# EasyEDA Pro project ProProject_TDeck_18650_Charger_2024-02-10.epro

# Schematic Schematic1
Create Date: 2024-02-10; Page Name: P1; Project Name: TDeck_18650_Charger; Schematic Name: Schematic1; Update Date: 2024-02-10; Company: EasyEDA.com; Drawn: EasyEDA; Page Size: A4; Part Number: JLCPCB-002; Reviewed: EasyEDA; Version: V0.1
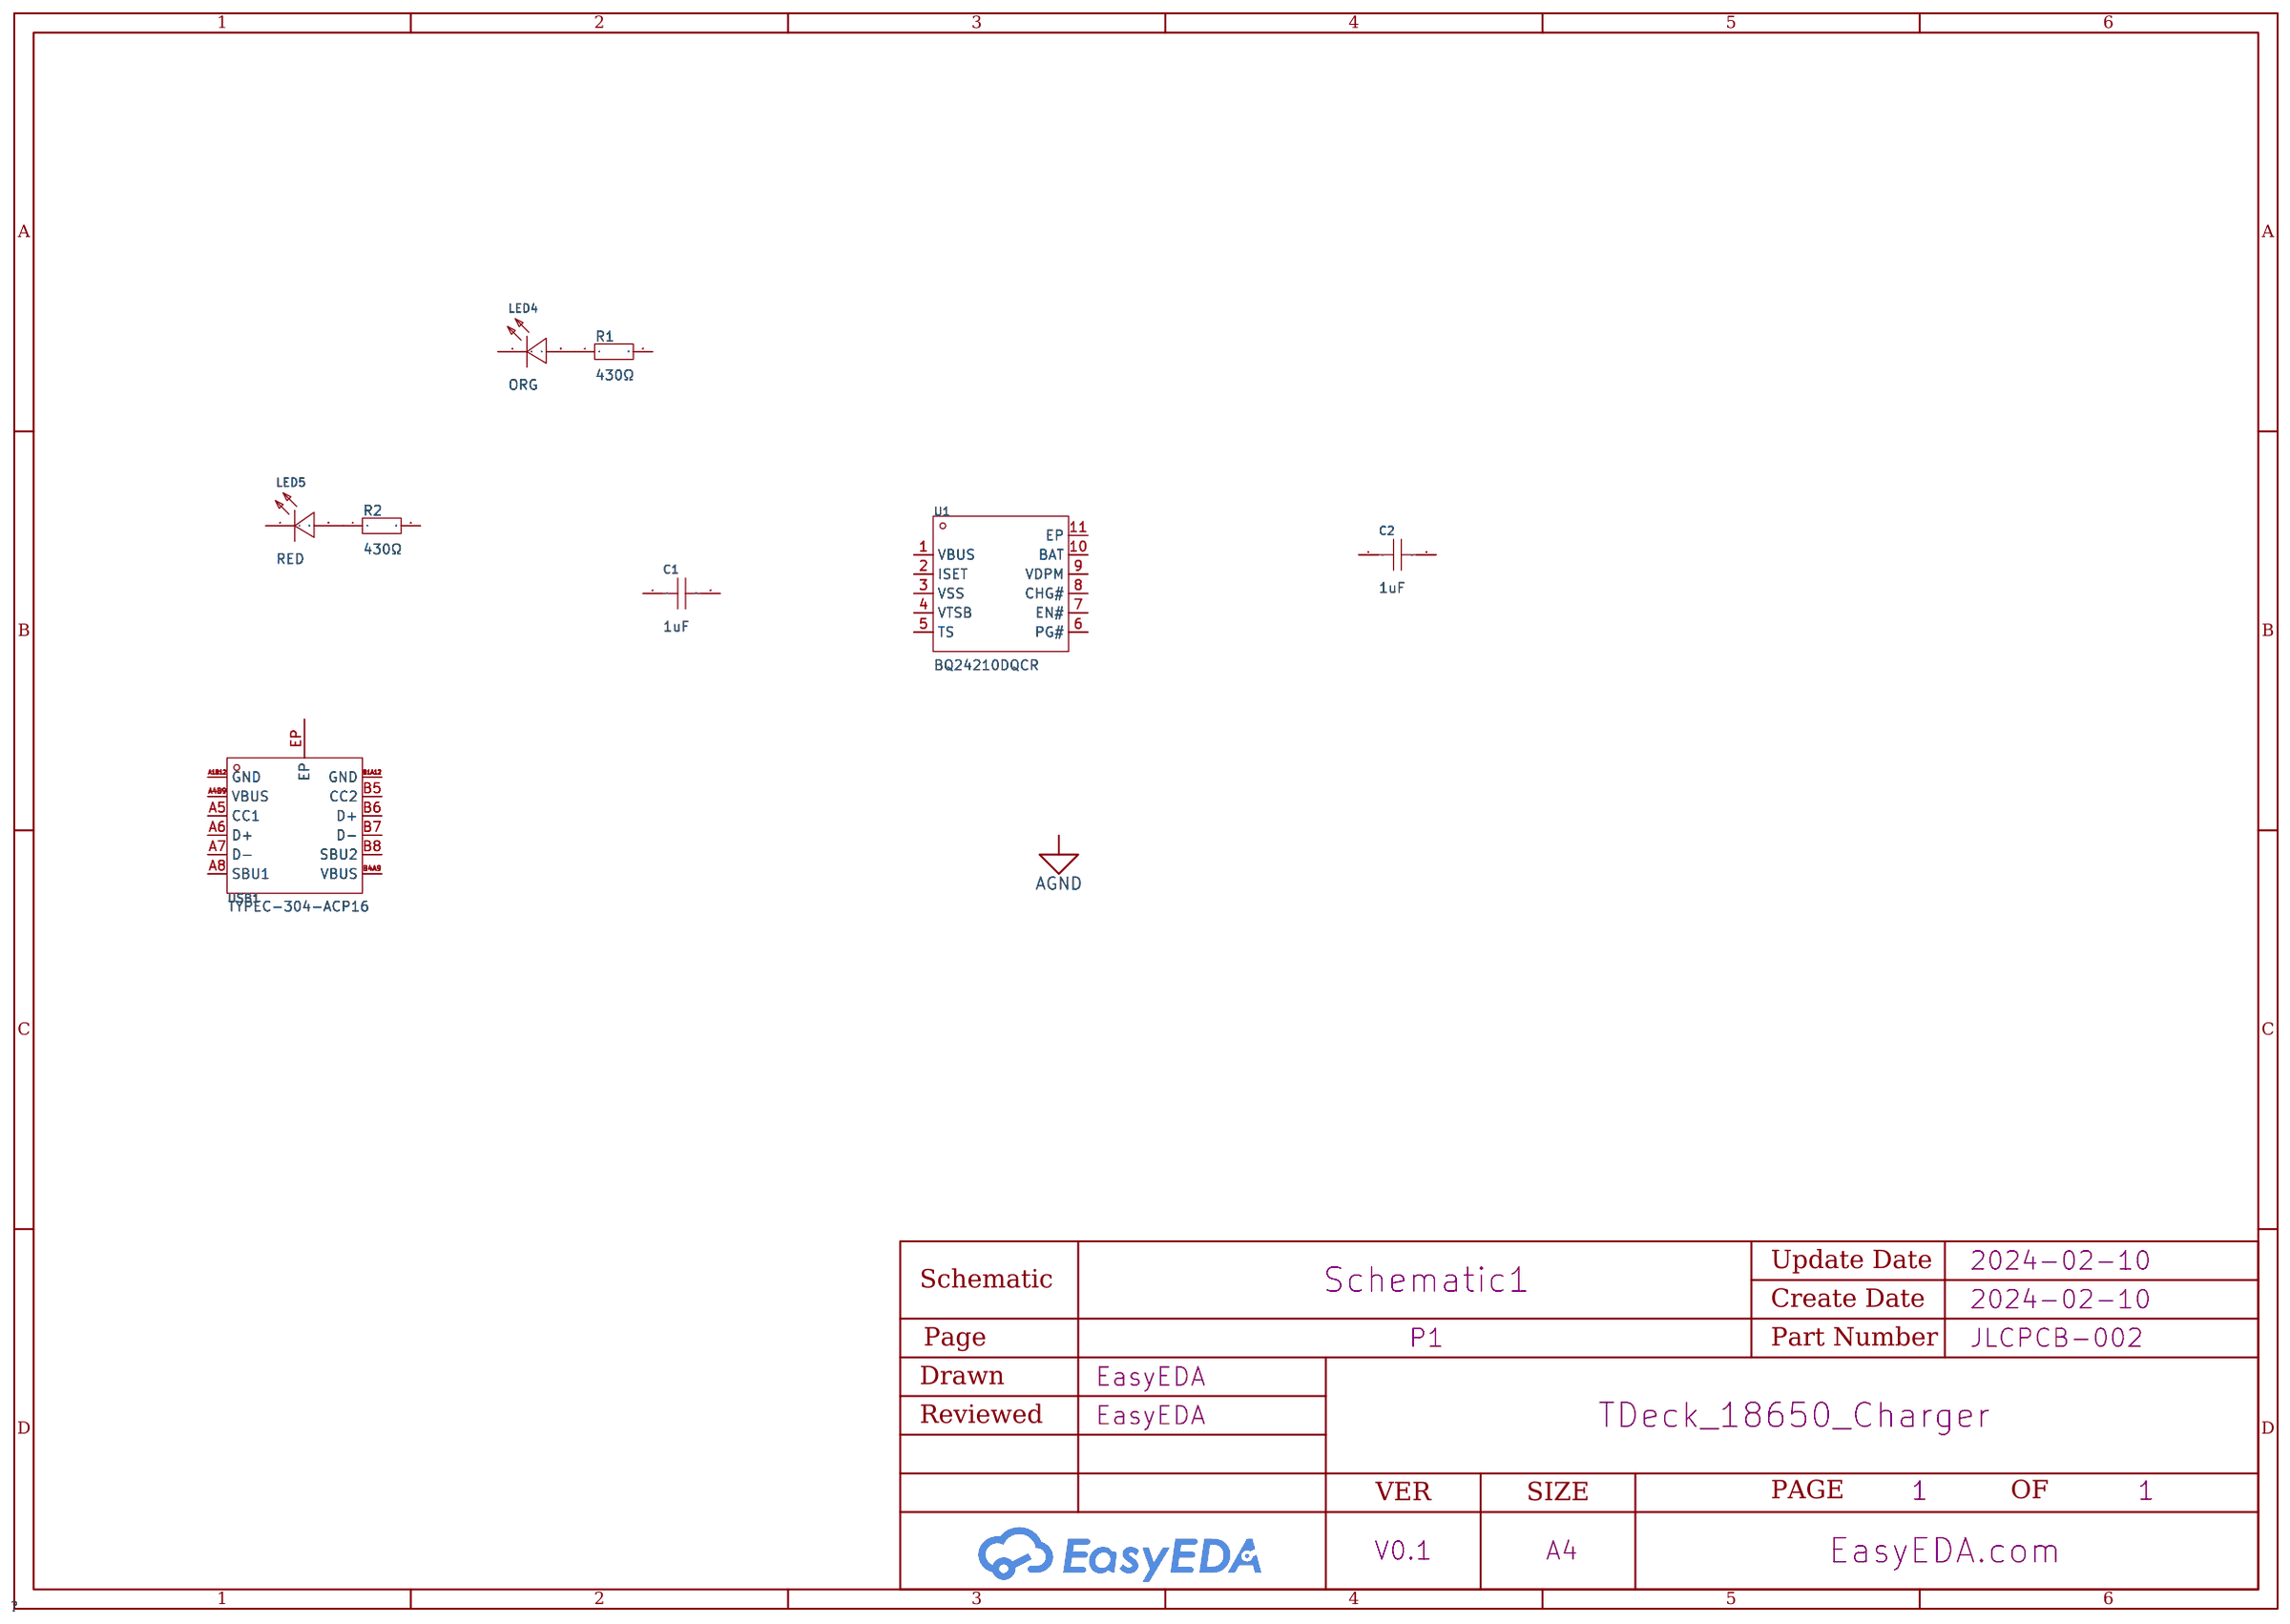
[diagram p0: schematic sheet]

## Parts
C1  1uF  [C1206]
C2  1uF  [C1206]
LED4  ORG  [LED0603-RD]
LED5  RED  [LED0805-RD]
R1  430Ω  [R0603]
R2  430Ω  [R0603]
U1  BQ24210DQCR  [WSON-10_L3.0-W2.0-P0.50-BL-EP]
USB1  TYPEC-304-ACP16  [USB-C-SMD_TYPE-C-16P-1]

## Library data of the parts
C1 C2 = CL31B105KCHNNNE: Capacitance: Tolerance:±10% Tolerance:±10% Voltage Rated: Temperature Coefficient:; LCSC Part Name: 1uF ±10% 100V; Supplier Part: C13832; Manufacturer: SAMSUNG(三星); Supplier Footprint: 1206; JLCPCB Part Class: Extended Part; Datasheet: https://atta.szlcsc.com/upload/public/pdf/source/20160218/1457707763339.pdf; Supplier: LCSC; Tolerance: ±10%
LED4 = NCD0603O2: Emitted Color:Orange Forward Voltage (VF):1.6V~2.6V Forward Voltage (VF):1.6V~2.6V Power Dissipation:65mW Forward Current:20mA Dominant Wavelength:600nm~610nm Dominant Wavelength:600nm~610nm Lens Color:无色透明透镜 Luminous Intensity:100mcd~220mcd Luminous Inte; Supplier Part: C108553; Manufacturer: 国星光电; Supplier Footprint: 0603; JLCPCB Part Class: Extended Part; Datasheet: https://atta.szlcsc.com/upload/public/pdf/source/20200820/C108553_1D8FD80A6A2BFA59936C6C85D97A3AAD.pdf; Supplier: LCSC; Emitted Color: Orange; Forward Voltage (VF): 1.6V~2.6V; Power Dissipation: 65mW; Forward Current: 20mA; Dominant Wavelength: 600nm~610nm; Lens Color: 无色透明透镜; Luminous Intensity: 100mcd~220mcd; Viewing Angle: 130°; Operating Temperature: -30℃~+85℃
LED5 = 17-21/R6C-AQ2R2B/3T: Emitted Color:Red; LCSC Part Name: 停产; Supplier Part: C113551; Manufacturer: EVERLIGHT(亿光); Supplier Footprint: 0805; JLCPCB Part Class: Extended Part; Datasheet: https://atta.szlcsc.com/upload/public/pdf/source/20170914/C113551_1505373979236968871.pdf; Supplier: LCSC; Emitted Color: Red
R1 R2 = 0603WAF4300T5E: Type:Thick Film Resistors Resistance: Tolerance:±1% Tolerance:±1% Power(Watts): Overload Voltage (Max): Temperature Coefficient:±100ppm/℃ Temperature Coefficient:±100ppm/℃ Operating Temperature Range:-55℃~+155℃ Operating Temperature Range:-55℃~+155℃; LCSC Part Name: 430Ω ±1% 100mW 厚膜电阻; Supplier Part: C23170; Manufacturer: UNI-ROYAL(厚声); Supplier Footprint: 0603; JLCPCB Part Class: Extended Part; Datasheet: https://atta.szlcsc.com/upload/public/pdf/source/20200306/C422600_1E6D84923E4A46A82E41ADD87F860B5C.pdf; Supplier: LCSC; Type: Thick Film Resistors; Tolerance: ±1%; Temperature Coefficient: ±100ppm/℃; Operating Temperature Range: -55℃~+155℃
U1 = BQ24210DQCR: Supplier Part: C524795; Manufacturer: TI(德州仪器); Supplier Footprint: WSON-10-EP(2x3); JLCPCB Part Class: Extended Part; Datasheet: https://www.ti.com/cn/lit/gpn/bq24210; Supplier: LCSC
USB1 = TYPEC-304-ACP16: Connector Type:Type-C Standard:- Gender:Female Number of Ports:1 Number of Contacts:16P Mounting Style:卧贴 Current Rating - Power (Max):3A Contact Material:Copper Contact Plating:Gold Operating Temperature Range:-40℃~+85℃ Operating Temperature Range:-40℃~+; LCSC Part Name: Type-C 母 卧贴; Supplier Part: C2982555; Manufacturer: XUNPU(讯普); Supplier Footprint: SMD; JLCPCB Part Class: Extended Part; Datasheet: https://atta.szlcsc.com/upload/public/pdf/source/20220311/3C907F75E12F45E4EE7F73565AB9C294.pdf; Supplier: LCSC; Connector Type: Type-C; Gender: Female; Number of Ports: 1; Number of Contacts: 16P; Mounting Style: 卧贴; Current Rating - Power (Max): 3A; Contact Material: Copper; Contact Plating: Gold; Operating Temperature Range: -40℃~+85℃

## Nets
Net-(LED4-2): LED4.2(A) R1.1
Net-(LED5-2): LED5.2(A) R2.1

Not connected (* = marked no-connect by the designer): C1 1 2; C2 1 2; LED4 1(K); LED5 1(K); R1 2; R2 2; U1 1(VBUS) 2(ISET) 3(VSS) 4(VTSB) 5(TS) 6(PG#) 7(EN#) 8(CHG#) 9(VDPM) 10(BAT) 11(EP); USB1 A1B12(GND) A4B9(VBUS) A5(CC1) A6(D+) A7(D-) A8(SBU1) B1A12(GND) B4A9(VBUS) B5(CC2) B6(D+) B7(D-) B8(SBU2) EP
